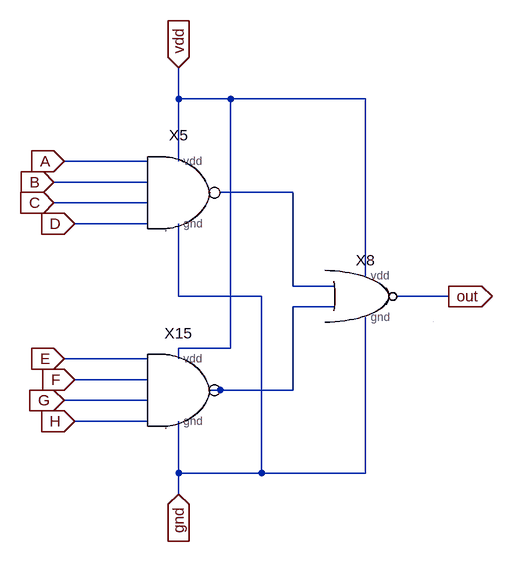
[diagram p0: schematic 8-1selor.asc]
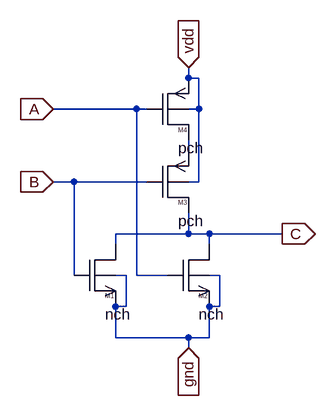
[diagram p1: sub-circuit mynor2.asc]
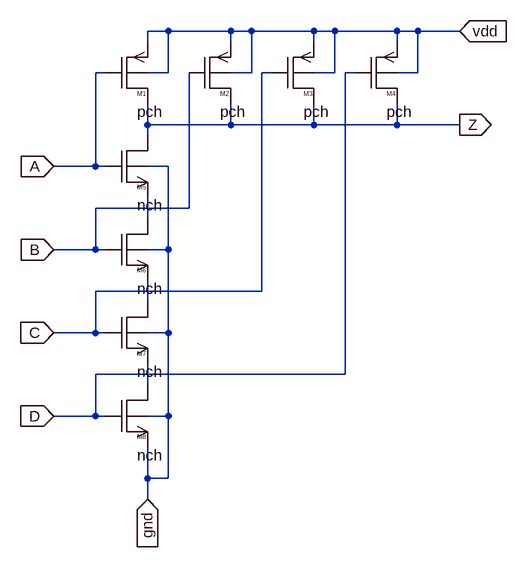
[diagram p2: sub-circuit mynand4.asc]
8-1selor.asc, the LTspice schematic file:
Version 4
SHEET 1 984 1020
WIRE 384 -112 384 -160
WIRE 464 -112 384 -112
WIRE 672 -112 464 -112
WIRE 336 -16 208 -16
WIRE 384 -16 384 -112
WIRE 336 16 192 16
WIRE 560 32 448 32
WIRE 336 48 192 48
WIRE 336 80 224 80
WIRE 672 160 672 -112
WIRE 560 176 560 32
WIRE 624 176 560 176
WIRE 384 192 384 80
WIRE 512 192 384 192
WIRE 800 192 720 192
WIRE 624 208 560 208
WIRE 464 272 464 -112
WIRE 464 272 384 272
WIRE 336 288 208 288
WIRE 384 288 384 272
WIRE 336 320 224 320
WIRE 448 336 432 336
WIRE 560 336 560 208
WIRE 560 336 448 336
WIRE 336 352 208 352
WIRE 336 384 224 384
WIRE 384 464 384 384
WIRE 512 464 512 192
WIRE 512 464 384 464
WIRE 672 464 672 224
WIRE 672 464 512 464
WIRE 384 496 384 464
FLAG 208 -16 A
IOPIN 208 -16 In
FLAG 192 16 B
IOPIN 192 16 In
FLAG 192 48 C
IOPIN 192 48 In
FLAG 224 80 D
IOPIN 224 80 In
FLAG 208 288 E
IOPIN 208 288 In
FLAG 224 320 F
IOPIN 224 320 In
FLAG 208 352 G
IOPIN 208 352 In
FLAG 224 384 H
IOPIN 224 384 In
FLAG 384 496 gnd
IOPIN 384 496 In
FLAG 384 -160 vdd
IOPIN 384 -160 In
FLAG 800 192 out
IOPIN 800 192 Out
SYMBOL mynor2 672 224 R0
SYMATTR InstName X8
SYMBOL mynand4 384 64 R0
SYMATTR InstName X5
SYMBOL mynand4 384 368 R0
SYMATTR InstName X15

mynor2.asc, the sub-circuit schematic file:
Version 4
SHEET 1 880 680
WIRE 240 -32 240 -48
WIRE 256 -32 240 -32
WIRE 160 16 32 16
WIRE 176 16 160 16
WIRE 256 16 256 -32
WIRE 256 16 240 16
WIRE 240 80 240 64
WIRE 64 128 32 128
WIRE 176 128 64 128
WIRE 256 128 256 16
WIRE 256 128 240 128
WIRE 240 208 240 176
WIRE 240 208 128 208
WIRE 272 208 240 208
WIRE 384 208 272 208
WIRE 128 224 128 208
WIRE 272 224 272 208
WIRE 64 272 64 128
WIRE 144 272 128 272
WIRE 160 272 160 16
WIRE 208 272 160 272
WIRE 288 272 272 272
WIRE 144 320 144 272
WIRE 144 320 128 320
WIRE 288 320 288 272
WIRE 288 320 272 320
WIRE 128 368 128 320
WIRE 240 368 128 368
WIRE 272 368 272 320
WIRE 272 368 240 368
WIRE 240 384 240 368
FLAG 32 16 A
IOPIN 32 16 In
FLAG 32 128 B
IOPIN 32 128 In
FLAG 384 208 C
IOPIN 384 208 Out
FLAG 240 -48 vdd
IOPIN 240 -48 In
FLAG 240 384 gnd
IOPIN 240 384 In
SYMBOL nmos4 64 272 R0
WINDOW 3 48 60 Left 2
SYMATTR InstName M1
SYMATTR Value nch
SYMATTR Value2 l=2u w=6u
SYMBOL nmos4 208 272 R0
WINDOW 3 48 60 Left 2
SYMATTR InstName M2
SYMATTR Value nch
SYMATTR Value2 l=2u w=6u
SYMBOL pmos4 176 128 R0
WINDOW 3 48 60 Left 2
SYMATTR InstName M3
SYMATTR Value pch
SYMATTR Value2 l=2u w=18u
SYMBOL pmos4 176 16 R0
WINDOW 3 48 60 Left 2
SYMATTR InstName M4
SYMATTR Value pch
SYMATTR Value2 l=2u w=18u

mynand4.asc, the sub-circuit schematic file:
Version 4
SHEET 1 880 680
WIRE 128 -240 96 -240
WIRE 224 -240 128 -240
WIRE 256 -240 224 -240
WIRE 352 -240 256 -240
WIRE 384 -240 352 -240
WIRE 480 -240 384 -240
WIRE 512 -240 480 -240
WIRE 576 -240 512 -240
WIRE 96 -224 96 -240
WIRE 224 -224 224 -240
WIRE 352 -224 352 -240
WIRE 480 -224 480 -240
WIRE 32 -176 16 -176
WIRE 128 -176 128 -240
WIRE 128 -176 96 -176
WIRE 256 -176 256 -240
WIRE 256 -176 224 -176
WIRE 288 -176 272 -176
WIRE 384 -176 384 -240
WIRE 384 -176 352 -176
WIRE 416 -176 400 -176
WIRE 512 -176 512 -240
WIRE 512 -176 480 -176
WIRE 96 -96 96 -128
WIRE 224 -96 224 -128
WIRE 224 -96 96 -96
WIRE 352 -96 352 -128
WIRE 352 -96 224 -96
WIRE 480 -96 480 -128
WIRE 480 -96 352 -96
WIRE 576 -96 480 -96
WIRE 96 -80 96 -96
WIRE 16 -32 16 -176
WIRE 16 -32 -48 -32
WIRE 32 -32 16 -32
WIRE 128 -32 96 -32
WIRE 160 32 160 -176
WIRE 160 32 16 32
WIRE 96 48 96 16
WIRE 16 96 16 32
WIRE 16 96 -48 96
WIRE 32 96 16 96
WIRE 128 96 128 -32
WIRE 128 96 96 96
WIRE 272 160 272 -176
WIRE 272 160 16 160
WIRE 96 176 96 144
WIRE 16 224 16 160
WIRE 16 224 -48 224
WIRE 32 224 16 224
WIRE 128 224 128 96
WIRE 128 224 96 224
WIRE 400 288 400 -176
WIRE 400 288 16 288
WIRE 96 304 96 272
WIRE 16 352 16 288
WIRE 16 352 -48 352
WIRE 32 352 16 352
WIRE 128 352 128 224
WIRE 128 352 96 352
WIRE 96 448 96 400
WIRE 128 448 128 352
WIRE 128 448 96 448
WIRE 96 480 96 448
FLAG -48 -32 A
IOPIN -48 -32 In
FLAG -48 96 B
IOPIN -48 96 In
FLAG -48 224 C
IOPIN -48 224 In
FLAG -48 352 D
IOPIN -48 352 In
FLAG 576 -96 Z
IOPIN 576 -96 Out
FLAG 96 480 gnd
IOPIN 96 480 In
FLAG 576 -240 vdd
IOPIN 576 -240 In
SYMBOL pmos4 32 -176 R0
WINDOW 3 48 60 Left 2
SYMATTR InstName M1
SYMATTR Value pch
SYMATTR Value2 l=2u w=18u
SYMBOL pmos4 160 -176 R0
WINDOW 3 48 60 Left 2
SYMATTR InstName M2
SYMATTR Value pch
SYMATTR Value2 l=2u w=18u
SYMBOL pmos4 288 -176 R0
WINDOW 3 48 60 Left 2
SYMATTR InstName M3
SYMATTR Value pch
SYMATTR Value2 l=2u w=18u
SYMBOL pmos4 416 -176 R0
WINDOW 3 48 60 Left 2
SYMATTR InstName M4
SYMATTR Value pch
SYMATTR Value2 l=2u w=18u
SYMBOL nmos4 32 -32 R0
WINDOW 3 48 60 Left 2
SYMATTR InstName M5
SYMATTR Value nch
SYMATTR Value2 l=2u w=6u
SYMBOL nmos4 32 96 R0
WINDOW 3 48 60 Left 2
SYMATTR InstName M6
SYMATTR Value nch
SYMATTR Value2 l=2u w=6u
SYMBOL nmos4 32 224 R0
WINDOW 3 48 60 Left 2
SYMATTR InstName M7
SYMATTR Value nch
SYMATTR Value2 l=2u w=6u
SYMBOL nmos4 32 352 R0
WINDOW 3 48 60 Left 2
SYMATTR InstName M8
SYMATTR Value nch
SYMATTR Value2 l=2u w=6u

The netlist it stands for:
* 8-1selor.asc
XX8 N001 N002 gnd vdd out mynor2
XX5 A B C D gnd vdd N001 mynand4
XX15 E F G H gnd vdd N002 mynand4

* block symbol definitions
.subckt mynor2 A B gnd vdd C
M1 C B gnd gnd nch l=2u w=6u
M2 C A gnd gnd nch l=2u w=6u
M3 C B N001 vdd pch l=2u w=18u
M4 N001 A vdd vdd pch l=2u w=18u
.ends mynor2

.subckt mynand4 A B C D gnd vdd Z
M1 Z A vdd vdd pch l=2u w=18u
M2 Z B vdd vdd pch l=2u w=18u
M3 Z C vdd vdd pch l=2u w=18u
M4 Z D vdd vdd pch l=2u w=18u
M5 Z A N001 gnd nch l=2u w=6u
M6 N001 B N002 gnd nch l=2u w=6u
M7 N002 C N003 gnd nch l=2u w=6u
M8 N003 D gnd gnd nch l=2u w=6u
.ends mynand4

.model NMOS NMOS
.model PMOS PMOS
.lib standard.mos
.backanno
.end